# EAGLE design irisc (EAGLE 9.2.2)
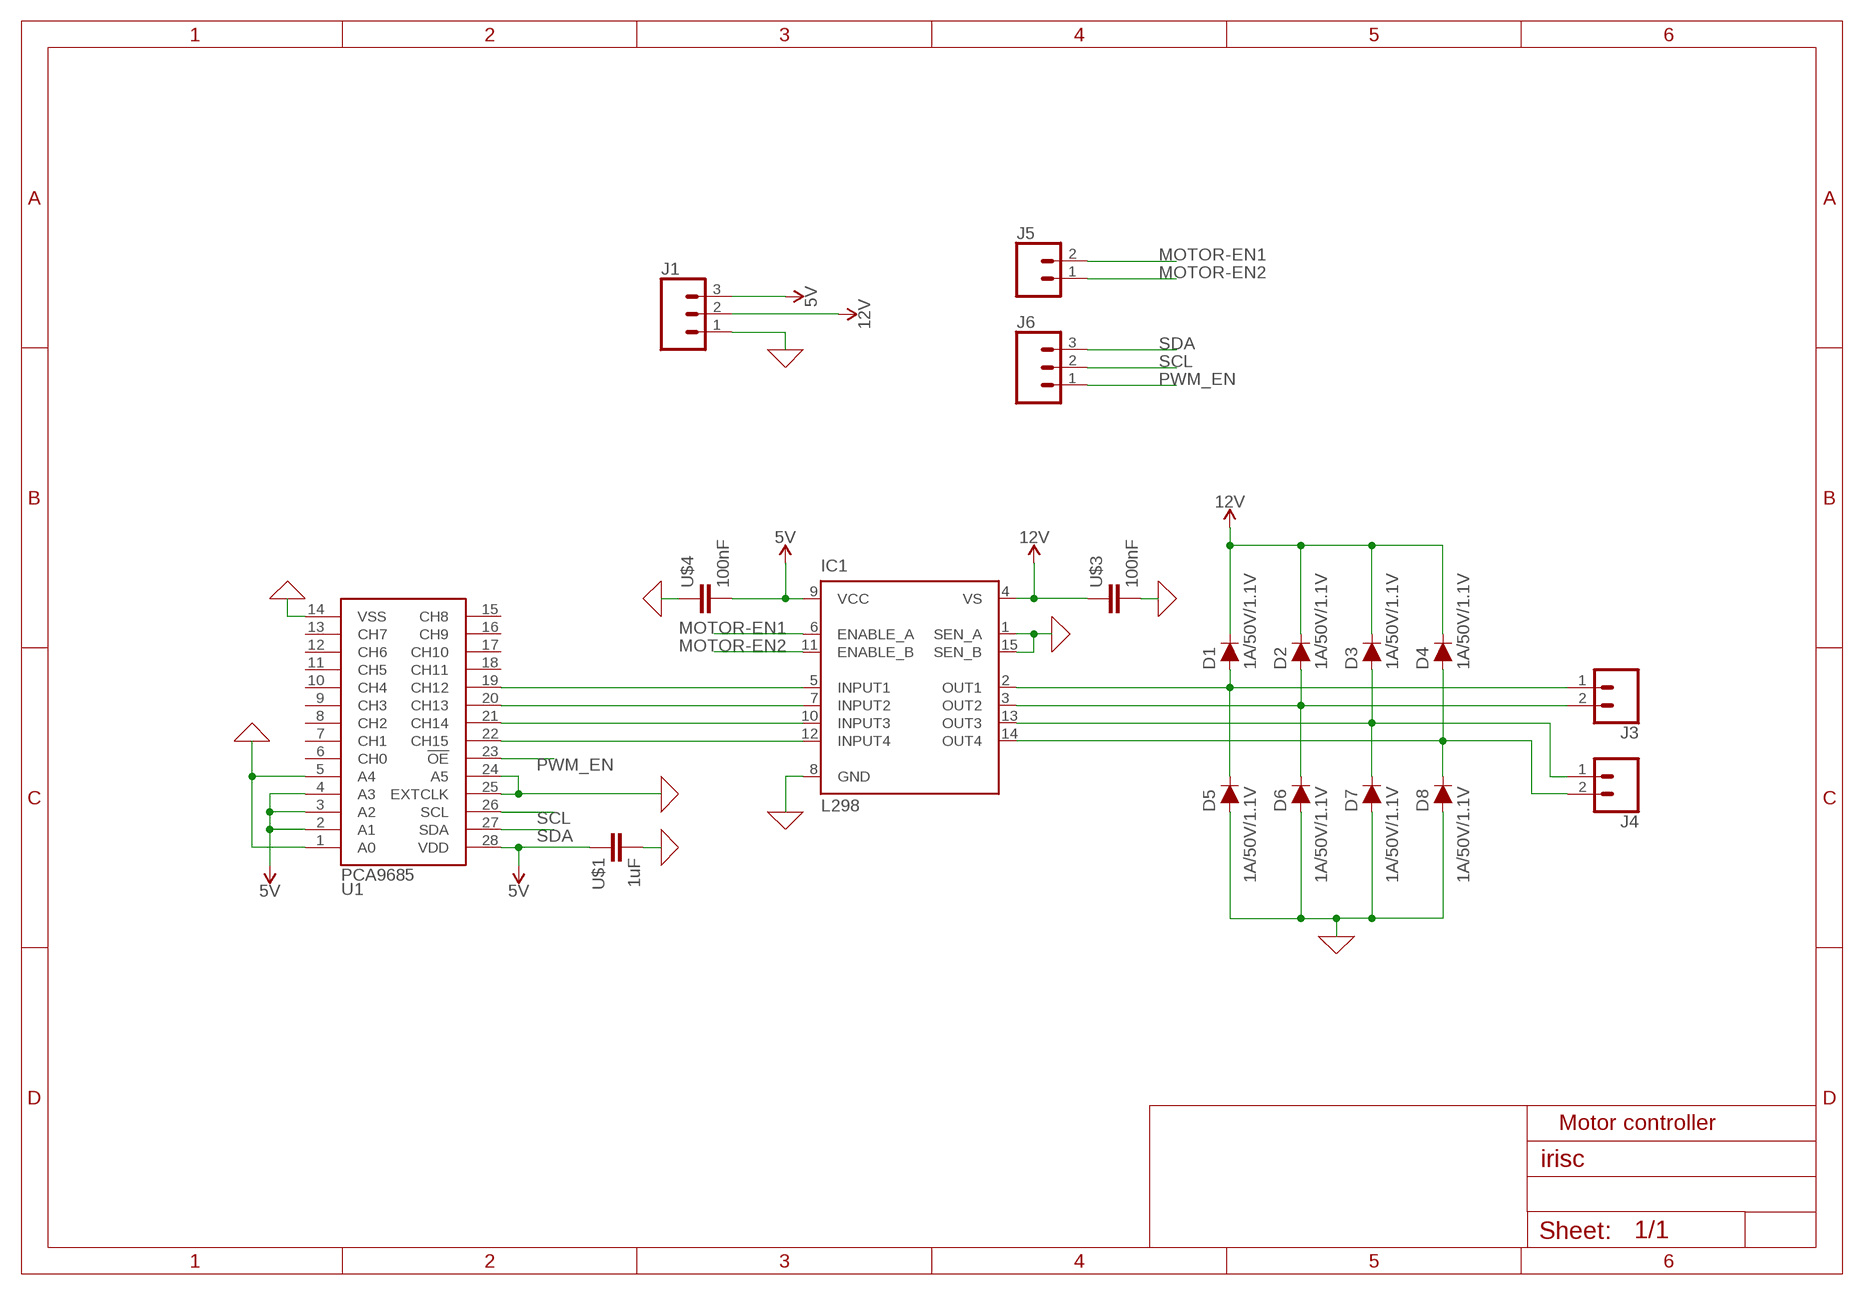
[diagram p0: schematic, sheet 1]

## Parts
D1  1A/50V/1.1V  DIODE-PTH  [DIODE-1N4001]
D2  1A/50V/1.1V  DIODE-PTH  [DIODE-1N4001]
D3  1A/50V/1.1V  DIODE-PTH  [DIODE-1N4001]
D4  1A/50V/1.1V  DIODE-PTH  [DIODE-1N4001]
D5  1A/50V/1.1V  DIODE-PTH  [DIODE-1N4001]
D6  1A/50V/1.1V  DIODE-PTH  [DIODE-1N4001]
D7  1A/50V/1.1V  DIODE-PTH  [DIODE-1N4001]
D8  1A/50V/1.1V  DIODE-PTH  [DIODE-1N4001]
IC1  L298  [MULTIWATT-15]
J1  CONN_03  [1X03]
J3  CONN_023.5MM  [SCREWTERMINAL-3.5MM-2]
J4  CONN_023.5MM  [SCREWTERMINAL-3.5MM-2]
J5  CONN_02  [1X02]
J6  CONN_03  [1X03]
U1  PCA9685  [TSSOP-28_4MM]
U$1  1uF  CAPACITOR_0805_L  [RESC0805_L]
U$3  100nF  CAPACITOR_0603_L  [RESC0603_L]
U$4  100nF  CAPACITOR_0603_L  [RESC0603_L]

## Nets
0: D5.A D6.A D7.A D8.A IC1.1(SEN_A) IC1.8(GND) IC1.15(SEN_B) J1.1 U1.1(A0) U1.5(A4) U1.14(VSS) U1.24(A5) U1.25(EXTCLK) U$1.2 U$3.2 U$4.1 ; supply symbol labelled GND
5V: IC1.9(VCC) J1.3 U1.2(A1) U1.3(A2) U1.4(A3) U1.28(VDD) U$1.1 U$4.2
12V: D1.C D2.C D3.C D4.C IC1.4(VS) J1.2 U$3.1
MOTOR-EN1: IC1.6(ENABLE_A) J5.2
MOTOR-EN2: IC1.11(ENABLE_B) J5.1
N$1: IC1.5(INPUT1) U1.19(CH12)
N$5: IC1.7(INPUT2) U1.20(CH13)
N$10: IC1.10(INPUT3) U1.21(CH14)
N$19: IC1.12(INPUT4) U1.22(CH15)
N$31: D1.A D5.C IC1.2(OUT1) J3.1
N$32: D2.A D6.C IC1.3(OUT2) J3.2
N$33: D3.A D7.C IC1.13(OUT3) J4.1
N$34: D4.A D8.C IC1.14(OUT4) J4.2
PWM_EN: J6.1 U1.23(!OE)
SCL: J6.2 U1.26(SCL)
SDA: J6.3 U1.27(SDA)
Unconnected: U1.6(CH0) U1.7(CH1) U1.8(CH2) U1.9(CH3) U1.10(CH4) U1.11(CH5) U1.12(CH6) U1.13(CH7) U1.15(CH8) U1.16(CH9) U1.17(CH10) U1.18(CH11)

## Notes on the sheet
- Motor controller

## Library data of the parts
D1-D8 = SparkFun-DiscreteSemi:DIODE: Diode These are standard reverse protection diodes and small signal diodes. SparkFun Products: SparkFun SparkPunk Sound Kit <https://www.sparkfun.com/products/11177> SparkFun ESP8266 Thing <https://www.sparkfun.com/products/13231>; PROD_ID: DIO-09176
IC1 = st-microelectronics:L298: DUAL FULL-BRIDGE DRIVER; MPN: L298N; OC_FARNELL: 1589425; OC_NEWARK: 32M1527; SPICEPREFIX: X
J1 J6 = SparkFun-Connectors:CONN_03: Multi connection point. Often used as Generic Header-pin footprint for 0.1 inch spaced/style header connections On any of the 0.1 inch spaced packages, you can populate with these: Break Away Headers - Straight <https://www.sparkfun.com/products/116> (PRT-00116) Break Away Male Headers - Right Angle <https://www.sparkfun.com/products/553> (PRT-00553) Female Headers <https://www.sparkfun.com/products/115> (PRT-00115) Break Away Headers - Machine Pin <https://www.sparkfun.com/products/117> (PRT-00117) Break Away Female Headers - Swiss Machine Pin <https://www.sparkfun.com/products/743> (PRT-00743) Stackable Header - 3 Pin (Female, 0.1") <https://www.sparkfun.com/products/13875> (PRT-13875) For SCREWTERMINALS and SPRING TERMINALS visit here: Screw Terimnals on SparkFun.com <https://www.sparkfun.com/search/results?term=Screw+Terminals> (5mm/3.5mm/2.54mm spacing) This device is also useful as a general connection point to wire up your design to another part of your project. Our various solder wires solder well into these plated through hole pads. Hook-Up Wire - Assortment (Stranded, 22 AWG) <https://www.sparkfun.com/products/11375> (PRT-11375) Hook-Up Wire - Assortment (Solid Core, 22 AWG) <https://www.sparkfun.com/products/11367> (PRT-11367) View the entire wire category on our website here <https://www.sparkfun.com/categories/141> Special notes: Molex polarized connector foot print use with SKU : PRT-08232 with associated crimp pins and housings.
J3 J4 = SparkFun-Connectors:CONN_02: Multi connection point. Often used as Generic Header-pin footprint for 0.1 inch spaced/style header connections On any of the 0.1 inch spaced packages, you can populate with these: Break Away Headers - Straight <https://www.sparkfun.com/products/116> (PRT-00116) Break Away Male Headers - Right Angle <https://www.sparkfun.com/products/553> (PRT-00553) Female Headers <https://www.sparkfun.com/products/115> (PRT-00115) Break Away Headers - Machine Pin <https://www.sparkfun.com/products/117> (PRT-00117) Break Away Female Headers - Swiss Machine Pin <https://www.sparkfun.com/products/743> (PRT-00743) For SCREWTERMINALS and SPRING TERMINALS visit here: Screw Terimnals on SparkFun.com <https://www.sparkfun.com/search/results?term=Screw+Terminals> (5mm/3.5mm/2.54mm spacing) This device is also useful as a general connection point to wire up your design to another part of your project. Our various solder wires solder well into these plated through hole pads. Hook-Up Wire - Assortment (Stranded, 22 AWG) <https://www.sparkfun.com/products/11375> (PRT-11375) Hook-Up Wire - Assortment (Solid Core, 22 AWG) <https://www.sparkfun.com/products/11367> (PRT-11367) View the entire wire category on our website here <https://www.sparkfun.com/categories/141> Special notes: Molex polarized connector foot print use with: PRT-08233 with associated crimp pins and housings. 2.54_SCREWTERM for use with PRT-10571. 3.5mm Screw Terminal footprints for PRT-08084 5mm Screw Terminal footprints for use with PRT-08432; PROD_ID: CONN-08399
J5 = SparkFun-Connectors:CONN_02: Multi connection point. Often used as Generic Header-pin footprint for 0.1 inch spaced/style header connections On any of the 0.1 inch spaced packages, you can populate with these: Break Away Headers - Straight <https://www.sparkfun.com/products/116> (PRT-00116) Break Away Male Headers - Right Angle <https://www.sparkfun.com/products/553> (PRT-00553) Female Headers <https://www.sparkfun.com/products/115> (PRT-00115) Break Away Headers - Machine Pin <https://www.sparkfun.com/products/117> (PRT-00117) Break Away Female Headers - Swiss Machine Pin <https://www.sparkfun.com/products/743> (PRT-00743) For SCREWTERMINALS and SPRING TERMINALS visit here: Screw Terimnals on SparkFun.com <https://www.sparkfun.com/search/results?term=Screw+Terminals> (5mm/3.5mm/2.54mm spacing) This device is also useful as a general connection point to wire up your design to another part of your project. Our various solder wires solder well into these plated through hole pads. Hook-Up Wire - Assortment (Stranded, 22 AWG) <https://www.sparkfun.com/products/11375> (PRT-11375) Hook-Up Wire - Assortment (Solid Core, 22 AWG) <https://www.sparkfun.com/products/11367> (PRT-11367) View the entire wire category on our website here <https://www.sparkfun.com/categories/141> Special notes: Molex polarized connector foot print use with: PRT-08233 with associated crimp pins and housings. 2.54_SCREWTERM for use with PRT-10571. 3.5mm Screw Terminal footprints for PRT-08084 5mm Screw Terminal footprints for use with PRT-08432
U1 = SparkFun-IC-Special-Function:PCA9685: 16-channel 12-bit PWM I2C interface Internal Oscillator 40Hz to 1kHz Can be totem pole or open collector 2.3V to 5.5V SparkFun Products SparkFun Block for Intel® Edison - PWM <https://www.sparkfun.com/products/13042> (DEV-13042) PROTO: IC-12240 PROD_ID: IC-12271; PROD_ID: IC-12271
U$1 U$3 U$4 = Nordic_nRF:CAPACITOR: Generic chip capacitor

## Board
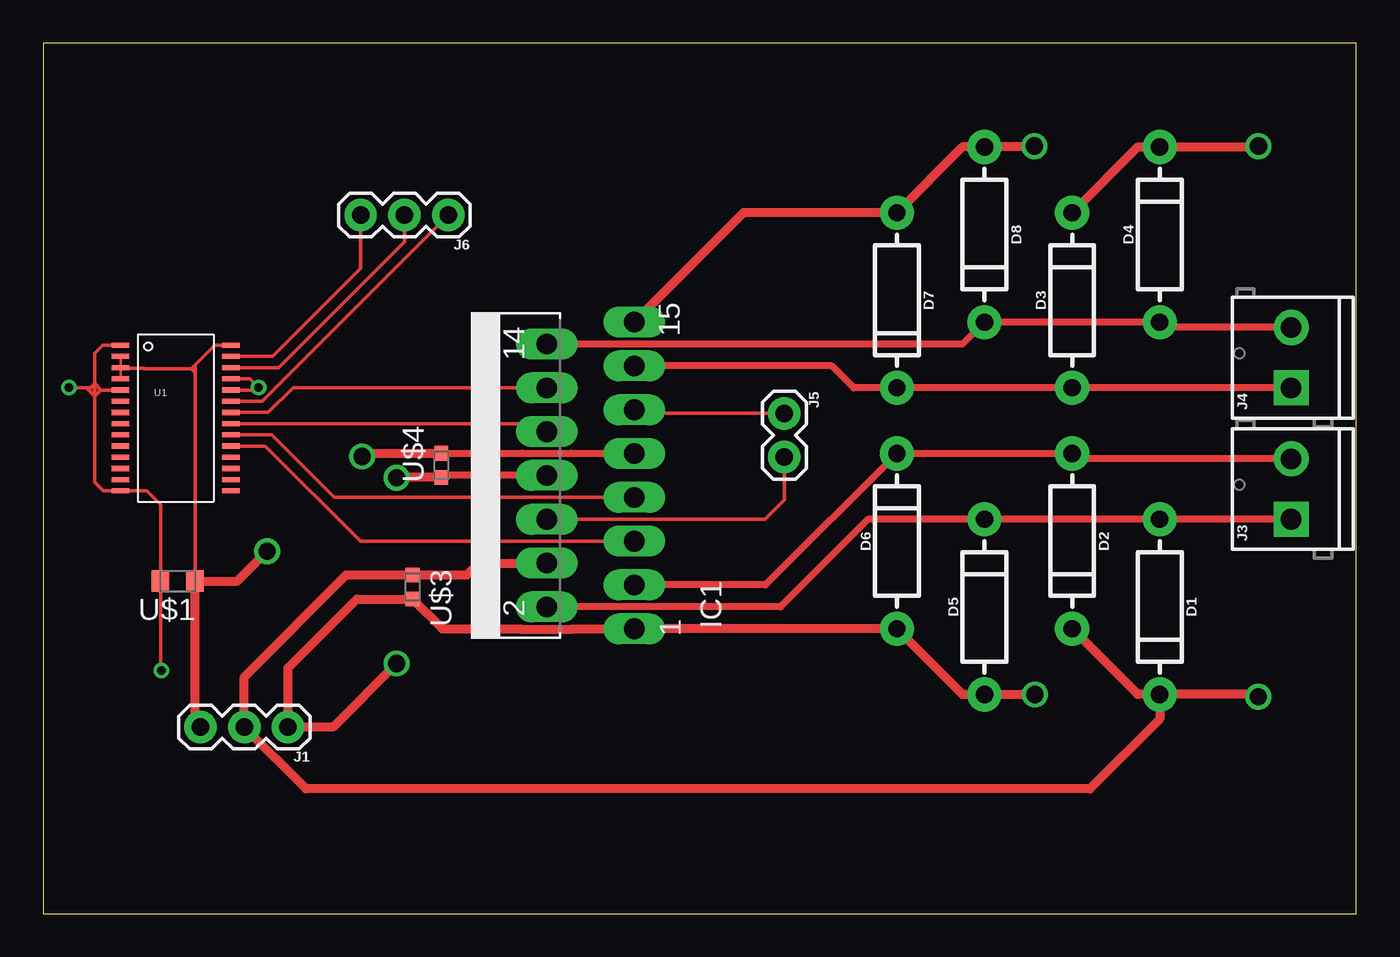
[diagram p1: board, top side]
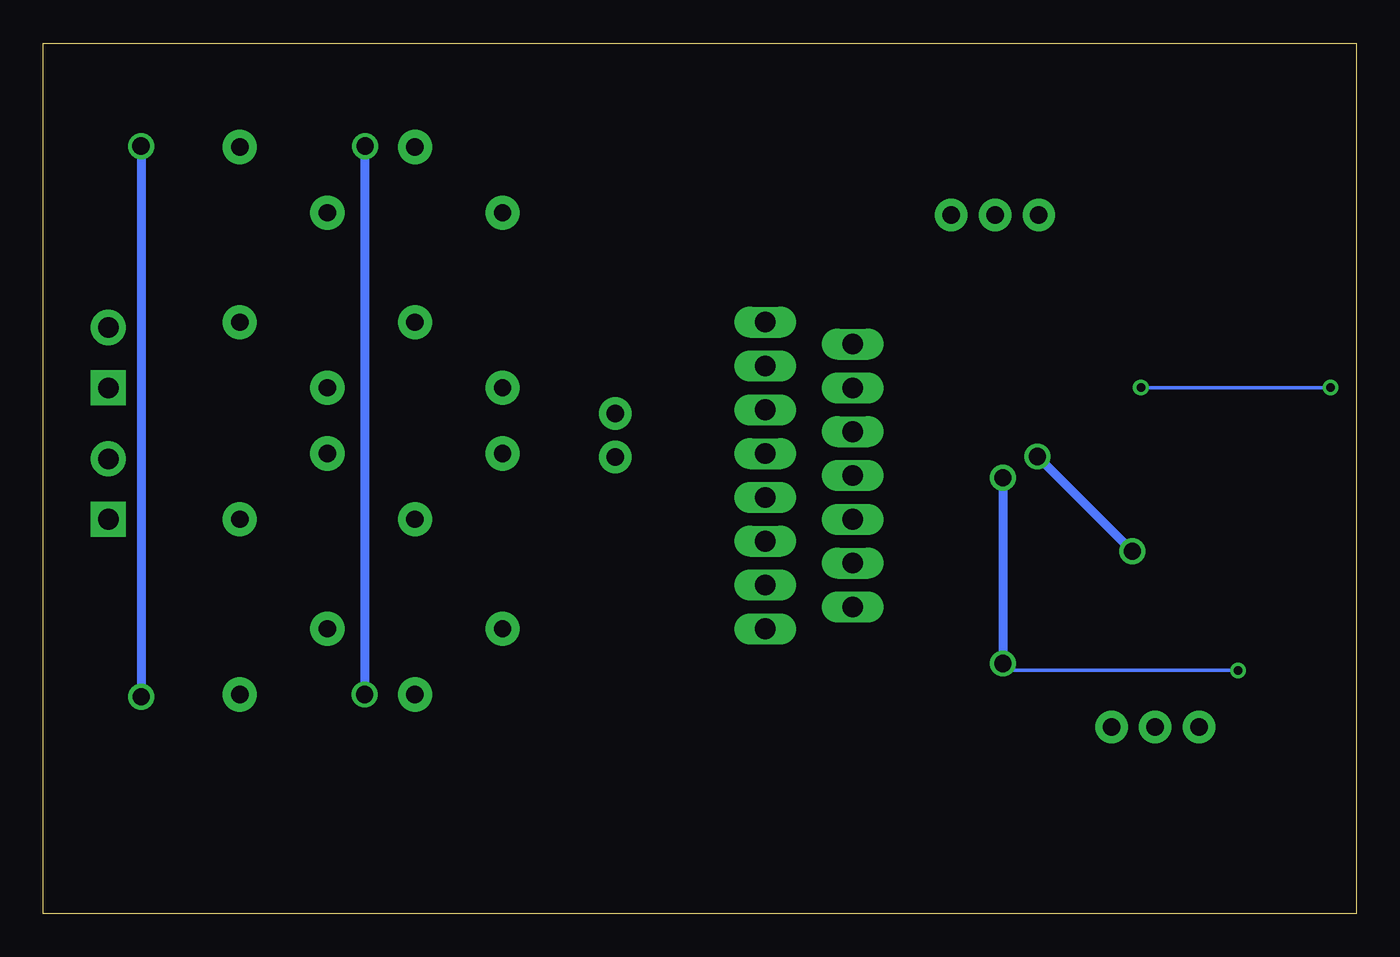
[diagram p2: board, bottom side, seen from below]

Size 76.18 x 50.47 mm. Coordinates in mm from the lower left corner, seen from the top.
Outline: 0,0 76.18,0 76.18,50.47 0,50.47 0,0
Copper layers (1*16): Top 0.035mm / dielectric 1.5mm / Bottom 0.035mm
Design rules "default": minimum track width 6mil, minimum drill 0.35mm, track to track 6mil, track to pad 6mil, pad to pad 6mil, via to via 6mil, smd to smd 6mil, copper to edge 40mil, drill to drill 6mil, minimum pad ring 10mil, minimum via ring 8mil, stop-mask expansion 4mil, vias tented up to drill 0mil, thermal gap 10mil

### Footprints (pad centres in the part's own frame; a part is rotated, then mirrored left to right if it is on the bottom)
DIODE-1N4001 = drill 1 pad 1.981: A -5.08,0; C 5.08,0
MULTIWATT-15 = drill 1.2 long: 1 -8.89,-7.62; 2 -7.62,-2.54; 3 -6.35,-7.62; 4 -5.08,-2.54; 5 -3.81,-7.62; 6 -2.54,-2.54; 7 -1.27,-7.62; 8 0,-2.54; 9 1.27,-7.62; 10 2.54,-2.54; 11 3.81,-7.62; 12 5.08,-2.54; 13 6.35,-7.62; 14 7.62,-2.54; 15 8.89,-7.62
1X03 = drill 1.016 pad 1.88: 1 0,0; 2 2.54,0; 3 5.08,0
SCREWTERMINAL-3.5MM-2 = drill 1.2 pad 2.032 square: 1 0,0 | drill 1.2 pad 2.032: 2 3.5,0
1X02 = drill 1.016 pad 1.88: 1 0,0; 2 2.54,0
TSSOP-28_4MM = smd 1 x 0.3: 1 -3.2,4.225; 2 -3.2,3.575; 3 -3.2,2.925; 4 -3.2,2.275; 5 -3.2,1.625; 6 -3.2,0.975; 7 -3.2,0.325; 8 -3.2,-0.325; 9 -3.2,-0.975; 10 -3.2,-1.625; 11 -3.2,-2.275; 12 -3.2,-2.925; 13 -3.2,-3.575; 14 -3.2,-4.225; 15 3.2,-4.225; 16 3.2,-3.575; 17 3.2,-2.925; 18 3.2,-2.275; 19 3.2,-1.625; 20 3.2,-0.975; 21 3.2,-0.325; 22 3.2,0.325; 23 3.2,0.975; 24 3.2,1.625; 25 3.2,2.275; 26 3.2,2.925; 27 3.2,3.575; 28 3.2,4.225
RESC0805_L = smd 1 x 1.25: 1 -1,0; 2 1,0
RESC0603_L = smd 0.85 x 0.8: 1 -0.7,0; 2 0.7,0

### Placement (x,y rotation side)
D1  64.77,17.78 270 top
D2  59.69,21.59 270 top
D3  59.69,35.56 90 top
D4  64.77,39.37 90 top
D5  54.61,17.78 90 top
D6  49.53,21.59 90 top
D7  49.53,35.56 270 top
D8  54.61,39.37 270 top
IC1  26.67,25.4 90 top
J1  14.21,10.81 180 top
J3  72.39,22.86 90 top
J4  72.39,30.48 90 top
J5  43,29 270 top
J6  23.5,40.5 180 top
U1  7.69,28.73 0 top
U$1  7.81,19.27 180 top
U$3  21.44,18.93 270 top
U$4  23.1,25.99 90 top

### Tracks (layer width: path | path; a pad name or v marks a point on that pad's centre or on a via)
0  (via drill 0.5, 1)
  Top 0.2: 3,30 3,25 3.5,24.5 U1.14 6,24.5 6.81,23.69 U$1.2 6.81,14.14 v6.86,14.1 | U1.1 3.46,32.95 3,32.5 3,30.73 | U1.5 3.38,30.36 | 3.38,30.36 3.35,30.36 3,30 | 3.38,30.36 3,30.73 | U1.25 11.99,31 v12.5,30.5 12.36,30.36 U1.24 | 3,30.73 3,30 | v1.5,30.5 2.5,30.5 | 2.5,30.5 3,30 | 2.5,30.5 2.77,30.5 3,30.73
  Top 0.406: IC1.8 23.21,25.4 U$4.1
  Top 0.508: v57.53,12.7 D5.A 53.34,12.7 D6.A IC1.1 30.69,16.51 30.65,16.47 27.77,16.47 27.73,16.51 23.16,16.51 U$3.2 18.19,18.23 14.21,14.25 J1.1 16.81,10.81 v20.5,14.5 | v57.5,44.5 57.45,44.45 D8.A 53.34,44.45 D7.A | D7.A 49.37,40.8 | D7.A 40.64,40.64 IC1.15 | U$4.1 20.52,25.29 v20.5,25.27
  Bottom 0.2: v12.5,30.5 v1.5,30.5 | v6.86,14.1 20.1,14.1 v20.5,14.5
  Bottom 0.508: v57.53,12.7 57.5,12.73 v57.5,44.5 | v20.5,25.27 v20.5,14.5
  pour Top: 3.05,30.73 3.43,30.35 3.05,29.97
  pour Top: 2.5,30.5 3,30 3,30.5
5V  (via drill 1)
  Top 0.152: U1.2 U1.3 U1.4
  Top 0.2: U1.28 9.96,32.95 8.81,31.81 | 8.81,31.81 8.81,31.37 | 8.81,31.37 U$1.1 | 8.81,31.81 8.59,31.59 | 8.59,31.59 8.81,31.37 | 8.59,31.59 5.88,31.59 5.84,31.62 4.52,31.62 U1.3
  Top 0.406: IC1.9 34.27,26.69 30.64,26.69 30.63,26.68 27.79,26.68 27.78,26.69 U$4.2
  Top 0.508: J1.3 8.81,11.13 U$1.1 11.27,19.27 v13,21 | v18.5,26.5 18.69,26.69 U$4.2
  Bottom 0.508: v13,21 v18.5,26.5
12V  (via drill 1)
  Top 0.406: 70.45,44.45 v70.5,44.5
  Top 0.508: D3.C 63.5,44.45 D4.C 70.45,44.45 | v70.48,12.57 70.36,12.7 D1.C | D1.C 63.5,12.7 D2.C | IC1.4 25.28,20.32 24.59,19.63 U$3.1 17.59,19.63 11.67,13.71 J1.2 15.25,7.23 60.73,7.23 64.77,11.27 D1.C
  Bottom 0.406: 70.5,12.59 v70.48,12.57
  Bottom 0.508: v70.5,44.5 70.5,12.59
MOTOR-EN1
  Top 0.2: J5.2 43,24 41.86,22.86 IC1.6
MOTOR-EN2
  Top 0.2: J5.1 34.5,29 IC1.11
N$1
  Top 0.2: IC1.5 18.41,21.59 12.89,27.11 U1.19
N$5
  Top 0.2: IC1.7 16.87,24.13 13.24,27.75 U1.20
N$10
  Top 0.2: U1.21 28.75,28.41 IC1.10
N$19
  Top 0.2: U1.22 13.05,29.05 14.5,30.5 29.19,30.5 IC1.12
N$31
  Top 0.406: J3.1 D1.A D5.C 47.86,22.86 42.78,17.78 IC1.2
N$32
  Top 0.406: J3.2 60,26.36 D2.A D6.C 41.91,19.05 IC1.3
N$33
  Top 0.406: J4.1 D3.A D7.C 47.02,30.48 45.75,31.75 IC1.13
N$34
  Top 0.2: D8.C 54.41,34.09
  Top 0.406: J4.2 65.08,33.98 D4.A D8.C | 54.41,34.09 53.34,33.02 IC1.14
PWM_EN
  Top 0.2: U1.23 12.71,29.7 J6.1
SCL
  Top 0.2: U1.26 13.65,31.66 20.96,38.96 J6.2
SDA
  Top 0.2: U1.27 13.3,32.3 18.42,37.42 J6.3